# EAGLE schematic FatBoy_v-0-0-0-1a (EAGLE 6.4)

## Sheet 1 of 11: AC-DC Conversion
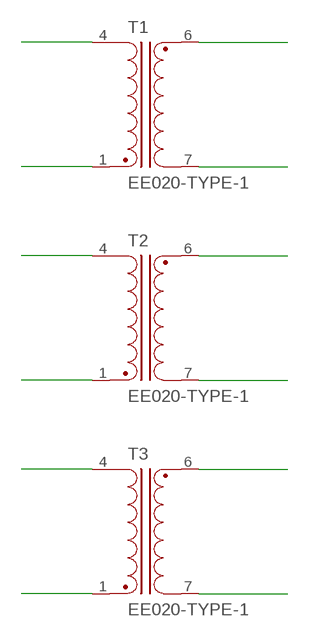
[diagram p0: schematic, sheet 1]

### Parts
T1  EE020-TYPE-1  [EE020]
T2  EE020-TYPE-1  [EE020]
T3  EE020-TYPE-1  [EE020]

### Nets
N$1: T1.7
N$2: T1.6
N$3: T2.6
N$4: T2.7
N$5: T3.6
N$6: T3.7
N$7: T1.4
N$8: T1.1
N$9: T2.4
N$10: T2.1
N$11: T3.4
N$12: T3.1

## Sheet 2 of 11: Digital 3v3

## Sheet 3 of 11: Analog 3v3

## Sheet 4 of 11: Analog 5V

## Sheet 5 of 11: Analog +/- 15V Left

## Sheet 6 of 11: Analog +/- 15V Right

## Sheet 7 of 11: PCM2707

## Sheet 8 of 11: PCM1794

## Sheet 9 of 11: I/V Converter

## Sheet 10 of 11: Amp Section

## Sheet 11 of 11: Buffer

## Library data of the parts
T1-T3 = pulse-eng:EE020-TYPE-1: POWER TRANSFORMER